# Altium schematic sheet M7_DSP_MCU_IO.SchDoc
size A3; SheetNumber: 1; SheetTotal: 5
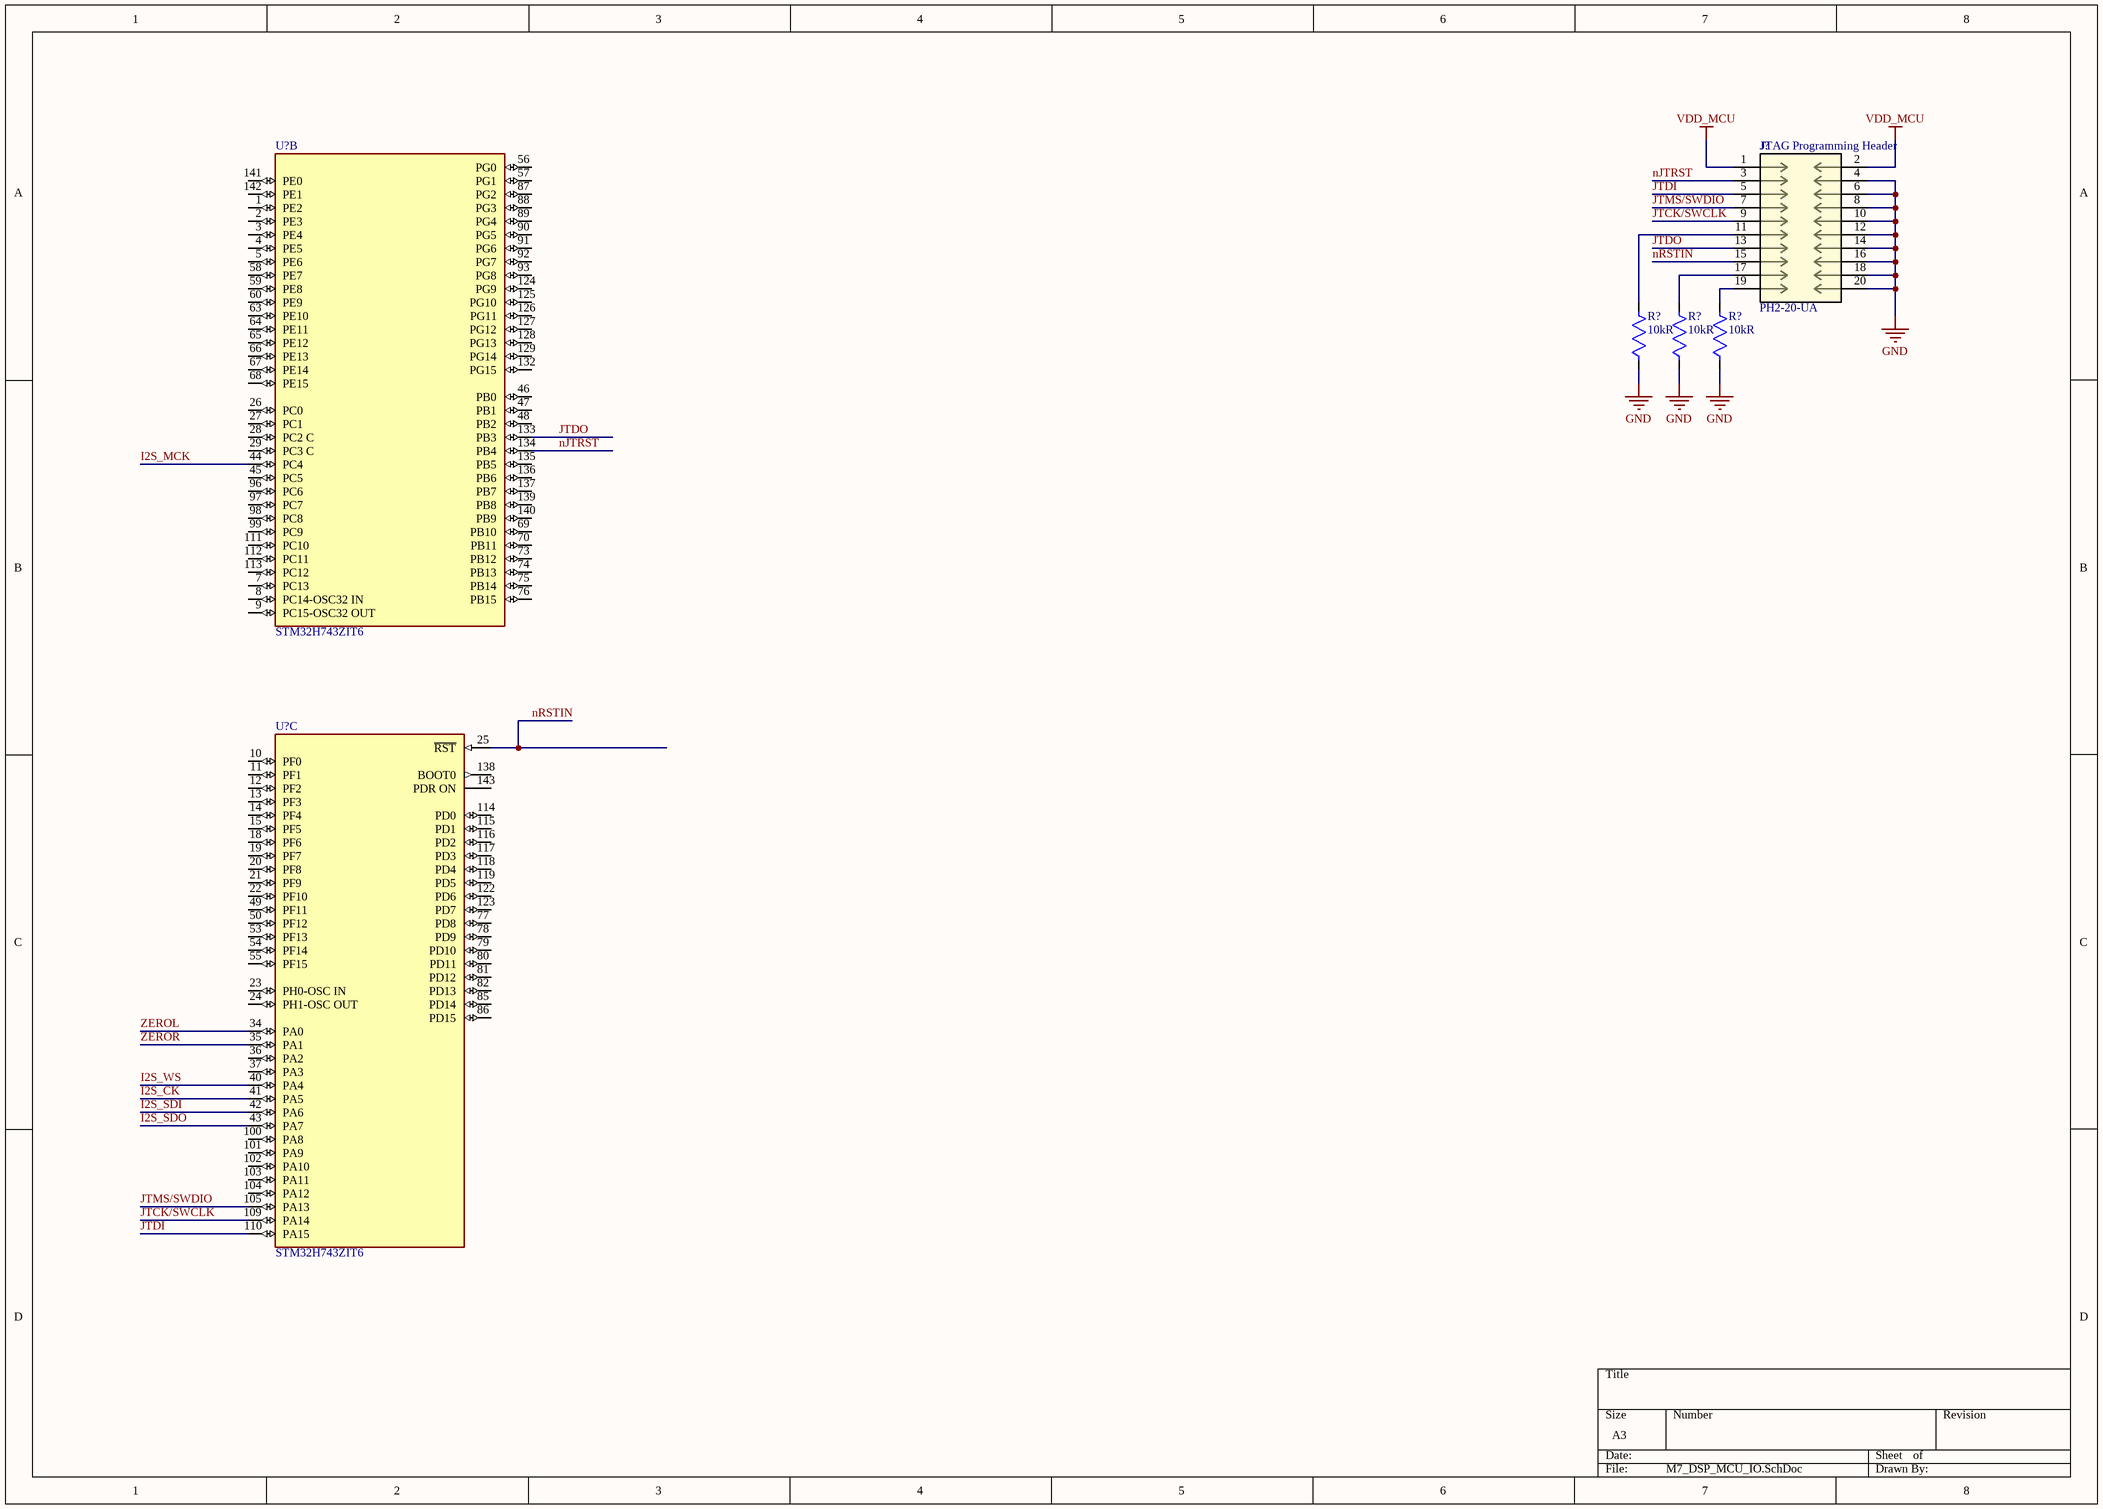
[diagram p0: M7_DSP_MCU_IO.SchDoc]

## Parts
(Parts that share a designator on the sheet are numbered #1, #2 ... from top to bottom, then left to right.)
J?  PH2-20-UA  [CONN_PH2-20-UA_ADM]
R?#1  Resistance: 10kR  [FP-AC0603-MFG]  (hidden comment: AC0603FR-0710KL)
R?#2  Resistance: 10kR  [FP-AC0603-MFG]  (hidden comment: AC0603FR-0710KL)
R?#3  Resistance: 10kR  [FP-AC0603-MFG]  (hidden comment: AC0603FR-0710KL)
U?#1  STM32H743ZIT6  [FP-LQFP144-1A-IPC_A]  (part B of 3)
U?#2  STM32H743ZIT6  [FP-LQFP144-1A-IPC_A]  (part C of 3)

## Nets
GND: J?.4 J?.6 J?.8 J?.10 J?.12 J?.14 J?.16 J?.18 J?.20 R?#1.1 R?#2.1 R?#3.1
VDD_MCU: J?.1 J?.2
I2S_CK: U?#2.41(PA5)
I2S_MCK: U?#1.44(PC4)
I2S_SDI: U?#2.42(PA6)
I2S_SDO: U?#2.43(PA7)
I2S_WS: U?#2.40(PA4)
JTCK/SWCLK: J?.9 U?#2.109(PA14)
JTDI: J?.5 U?#2.110(PA15)
JTDO: J?.13 U?#1.133(PB3)
JTMS/SWDIO: J?.7 U?#2.105(PA13)
nJTRST: J?.3 U?#1.134(PB4)
nRSTIN: J?.15 U?#2.25(~{RST})
ZEROL: U?#2.34(PA0)
ZEROR: U?#2.35(PA1)
NetJ?_11: J?.11 R?#1.2
NetJ?_17: J?.17 R?#2.2
NetJ?_19: J?.19 R?#3.2

Not connected (* = marked no-connect by the designer): U?#1 1(PE2) 2(PE3) 3(PE4) 4(PE5) 5(PE6) 7(PC13) 8(PC14-OSC32_IN) 9(PC15-OSC32_OUT) 26(PC0) 27(PC1) 28(PC2_C) 29(PC3_C) 45(PC5) 46(PB0) 47(PB1) 48(PB2) 56(PG0) 57(PG1) 58(PE7) 59(PE8) 60(PE9) 63(PE10) 64(PE11) 65(PE12) 66(PE13) 67(PE14) 68(PE15) 69(PB10) 70(PB11) 73(PB12) 74(PB13) 75(PB14) 76(PB15) 87(PG2) 88(PG3) 89(PG4) 90(PG5) 91(PG6) 92(PG7) 93(PG8) 96(PC6) 97(PC7) 98(PC8) 99(PC9) 111(PC10) 112(PC11) 113(PC12) 124(PG9) 125(PG10) 126(PG11) 127(PG12) 128(PG13) 129(PG14) 132(PG15) 135(PB5) 136(PB6) 137(PB7) 139(PB8) 140(PB9) 141(PE0) 142(PE1); U?#2 10(PF0) 11(PF1) 12(PF2) 13(PF3) 14(PF4) 15(PF5) 18(PF6) 19(PF7) 20(PF8) 21(PF9) 22(PF10) 23(PH0-OSC_IN) 24(PH1-OSC_OUT) 36(PA2) 37(PA3) 49(PF11) 50(PF12) 53(PF13) 54(PF14) 55(PF15) 77(PD8) 78(PD9) 79(PD10) 80(PD11) 81(PD12) 82(PD13) 85(PD14) 86(PD15) 100(PA8) 101(PA9) 102(PA10) 103(PA11) 104(PA12) 114(PD0) 115(PD1) 116(PD2) 117(PD3) 118(PD4) 119(PD5) 122(PD6) 123(PD7) 138(BOOT0) 143(PDR_ON)

## Notes on the sheet
- (near J?) JTAG Programming Header

## Library data of the parts
J? = PH2-20-UA: Conn Unshrouded Header HDR 15 POS 2.54mm Solder ST Thru-Hole Bag; Mfr_Name: ADAM TECHNOLOGIES INC; Manufacturer: Adam Equipment; Number of Positions: 20; Type: DEV; Copyright: Copyright (C) 2024 Ultra Librarian. All rights reserved.; Manufacturer_Part_Number: PH2-20-UA; RefDes: RefDes; Supplier 1: Future Electronics; Manufacturer Part Number: PH2-20-UA; RoHS: Yes; Category: Connectors; Pricing 1: 1000=0.132, 3000=0.128, 5000=0.126, 15000=0.122, 25000=0.119 (USD); Mounting Technology: Through Hole; Contact Plating: Gold; Termination: Solder; Packaging: Bag; Pitch: 2.54mm; Lead Free: Lead Free; ComponentLink1URL: https://datasheet.ciiva.com/16479/page-312-315-16479356.pdf?src-supplier=Future+Electronics; ComponentLink1Description: https://datasheet.ciiva.com/16479/page-312-315-16479356.pdf?src-supplier=Future+Electronics; Supplier Part Number 1: 2074617
R?#1-R?#3 = CMP-2000-04818-3: RES 10KΩ 1.00% 0.1W 0603; Power Rating: 100mW; Tolerance: 1%; Voltage Rating: 50V; Temperature Coefficient: 100ppm/°C; Ratings: AEC-Q200; Case Code (Metric): 1608; Max Power Dissipation: 100mW; Height: 0.45mm; Package Quantity: 1; Max Operating Temperature: 155°C; Resistor Type: Thick Film; Depth: 0.8mm; RoHS Compliant: Yes; Min Operating Temperature: -55°C; Packaging: Tape and Reel; Number of Terminations: 2; Length: 1.6mm; Features: Moisture Resistant; Military Standard: Not; Case Code (Imperial): 0603; Size Code: 0603; Termination: SMD/SMT; Case/Package: 0603; Mount: Surface Mount; Width: 0.8mm; Lead Free: Lead Free; Series: AC; Construction: Rectangular; Supplier 1: Future Electronics; Supplier Part Number 1: 2029400
U?#1 U?#2 = CMP-12105-000003-1: IC MCU 32BIT 2MB FLASH 144LQFP; Manufacturer: STMicroelectronics; Number Of I2C Channels: 4; Number Of A/D Converters: 2; Standoff Height: 0.05mm; Interface: I2C,SPI,UART,USART,EBI/EMI,CAN,USB,LIN,IrDA,Other; Max Supply Voltage: 3.6V; Number Of Adc Channels: 36; Ram Size: 1MBytes; Number Of Cores: 1; Frequency: 400MHz; Data Bus Width: 32bits; Core Architecture: ARM Cortex-M7; Memory Size: 2MBytes; Number Of Timers/Counters: 22; Min Supply Voltage: 1.62V; Number Of Spi Channels: 6; Max Junction Temp: +125°C; Number Of I/Os: 114; Digikey Description: IC MCU 32BIT 2MB FLASH 144LQFP; Device Class L2: Embedded Processors and Controllers; Number Of Usb Channels: 2; ComponentLink2Description: Datasheet; Ipc Land Pattern Name: QFP50P2200X2200X160-144; Category: IC; Lead Free: Yes; Temperature Range High: +85°C; Mouser Description: MCU 32-Bit STM32 ARM Cortex M7 RISC 2MB Flash 1.8V/2.5V/3.3V 144-Pin LQFP Tray; RoHS: TRUE; Ambient Temperature Range Low: -40°C; Temperature Range Low: -40°C; ComponentLink2URL: https://www.st.com/resource/en/datasheet/stm32h743zi.pdf; Ambient Temperature Range High: +85°C; Octopart: https://octopart.com/stm32h743zit6-stmicroelectronics-76372529; Number Of Pwm Channels: 2; Height: 1.6mm; Manufacturer Part Number: STM32H743ZIT6; Device Class L3: Microcontrollers; Device Class L1: Integrated Circuits (ICs); Automotive: No; Memory Type: FLASH; Number Of Uart Channels: 4; Package: LQFP144-1A; Temperature: -40°C to +85°C; Supplier 1: Mouser; Supplier Part Number 1: 511-STM32H743ZIT6